# EAGLE design epaper (EAGLE 7.2.0)
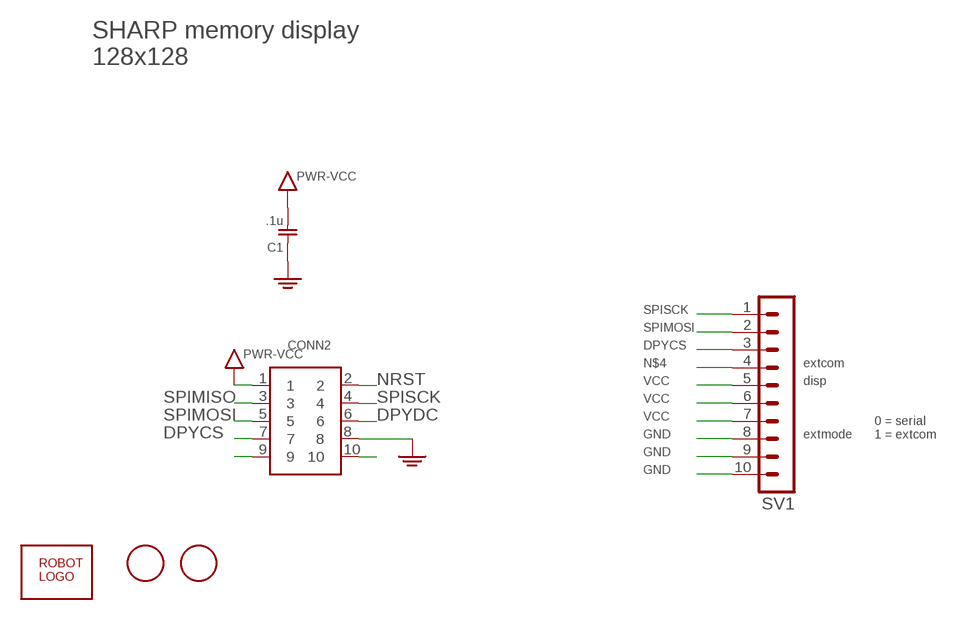
[diagram p0: schematic, sheet 1]

## Parts
C1  .1u  C0603  [SMD0603]
CONN2  HEADER-5X2-PTH  [HEADER-5X2-PTH]
SV1  MA10-1-M05/FFC  [M05-1X10-RA]
U$1  ROBOTMAN-LOGO2  [ROBOTMAN-LOGO2]
U$2  FIDUCIAL  [FIDUCIAL_1MM]
U$3  FIDUCIAL  [FIDUCIAL_1MM]

## Nets
DPYCS: CONN2.7 SV1.3
DPYDC: CONN2.6
GND: C1.1 CONN2.8 SV1.8 SV1.9 SV1.10 ; supply symbol labelled PWR-GND
N$4: SV1.4
N$12: CONN2.9
N$19: CONN2.10
NRST: CONN2.2
SPIMISO: CONN2.3
SPIMOSI: CONN2.5 SV1.2
SPISCK: CONN2.4 SV1.1
VCC: C1.2 CONN2.1 SV1.5 SV1.6 SV1.7 ; supply symbol labelled PWR-VCC

## Notes on the sheet
- SHARP memory display
  128x128
- extcom
- disp
- extmode
- 0 = serial
  1 = extcom

## Library data of the parts
C1 = jaw:C
CONN2 = jaw:HEADER-5X2
SV1 = jaw:MA10-1: PIN HEADER
U$1 = jaw:ROBOTMAN-LOGO
U$2 U$3 = adafruit:FIDUCIAL: For use by pick and place machines to calibrate the vision/machine, 1mm By microbuilder.eu

## Board
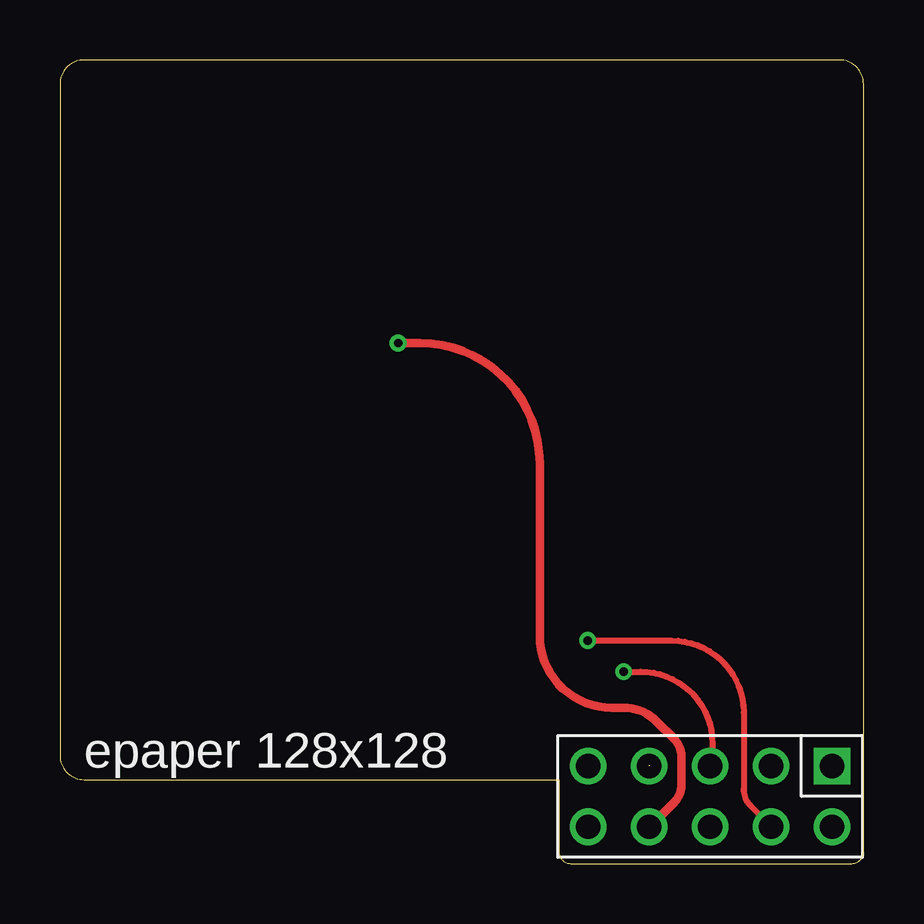
[diagram p1: board, top side]
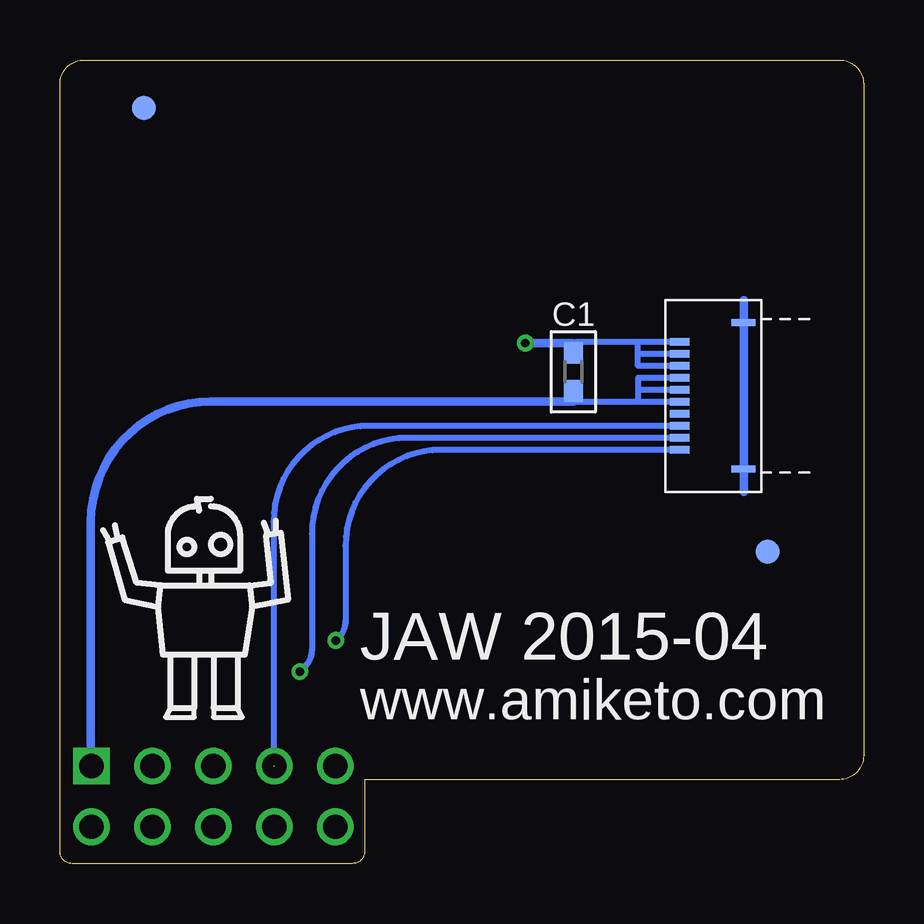
[diagram p2: board, bottom side, seen from below]

Size 33.5 x 33.5 mm. Coordinates in mm from the lower left corner, seen from the top.
Outline: 20.8,3.5 20.8,0.5 arc90 21.3,0 33,0 arc90 33.5,0.5 33.5,32.5 arc90 32.5,33.5 1,33.5 arc90 0,32.5 0,4.5 arc90 1,3.5 20.5,3.5 20.8,3.5
Copper layers (1*16): Top 0.0356mm / dielectric 1.5011mm / Bottom 0.0356mm
Design rules "LaenPCBOrder *": minimum track width 6mil, minimum drill 13mil, track to track 6mil, track to pad 6mil, pad to pad 6mil, via to via 6mil, smd to smd 6mil, copper to edge 15mil, drill to drill 6mil, minimum pad ring 7mil, minimum via ring 7mil, stop-mask expansion 4mil, vias tented up to drill 0.5mm, thermal gap 10mil

### Footprints (pad centres in the part's own frame; a part is rotated, then mirrored left to right if it is on the bottom)
SMD0603 = smd 0.9 x 0.8: 1 -0.8,0; 2 0.8,0
HEADER-5X2-PTH = drill 1.016 square: 1 -5.08,-1.27 | drill 1.016: 2 -5.08,1.27; 3 -2.54,-1.27; 4 -2.54,1.27; 5 0,-1.27; 6 0,1.27; 7 2.54,-1.27; 8 2.54,1.27; 9 5.08,-1.27; 10 5.08,1.27
M05-1X10-RA = smd 0.3 x 0.8: 1 -2.25,1.67; 2 -1.75,1.67; 3 -1.25,1.67; 4 -0.75,1.67; 5 -0.25,1.67; 6 0.25,1.67; 7 0.75,1.67; 8 1.25,1.67; 9 1.75,1.67; 10 2.25,1.67 | smd 0.3 x 1: P$13 3.05,-0.98; P$14 -3.05,-0.98
FIDUCIAL_1MM = smd 1 x 1: 1 0,0

### Placement (x,y rotation side)
C1  12.1,20.5 270 bottom
CONN2  27.1,2.8 180 top
SV1  6,19.5 90 bottom
U$1  27.5,10.5 0 bottom
U$2  30,31.5 0 bottom
U$3  4,13 0 bottom

### Tracks (layer width: path | path; a pad name or v marks a point on that pad's centre or on a via)
DPYCS  (1 unrouted)
  Bottom 0.25: SV1.3 20.6,18.25 arc-90 24.6,14.25 24.6,4.08
GND  (via drill 0.35)
  Top 0.35: v14.1,21.7 15,21.7 arc-90 20,16.7 20,9.5 arc90 23,6.5 23.47,6.5 arc-45 24.89,5.91 25.61,5.19 arc-45 25.9,4.49 25.9,3.25 arc-45 25.61,2.55 24.59,1.53 CONN2.8
  Bottom 0.25: SV1.10 9.4,21.75 | 9.4,21.75 11.98,21.75 C1.1 | SV1.9 9.4,21.25 | 9.4,21.25 9.4,21.75 | SV1.8 9.4,20.75 9.4,21.25
  Bottom 0.35: v14.1,21.7 12.13,21.7 C1.1
N$1
  Bottom 0.35: 5,15.5 5,23.5
SPIMOSI  (via drill 0.35)
  Top 0.25: v23.5,8 24.2,8 arc-90 27.2,5 27.2,4.14 27.13,4.07 CONN2.5
  Bottom 0.25: SV1.2 19,17.75 arc-90 23,13.75 23,8.91 arc45 23.29,8.21 v23.5,8
SPISCK  (via drill 0.35)
  Top 0.25: v22,9.3 25.5,9.3 arc-90 28.5,6.3 28.5,3.11 arc45 28.79,2.41 29.64,1.56 CONN2.4
  Bottom 0.25: SV1.1 17.6,17.25 arc-90 21.6,13.25 21.6,10.11 arc45 21.89,9.41 v22,9.3
VCC
  Bottom 0.25: SV1.5 9.4,19.25 | SV1.6 9.4,19.75 | 9.4,19.75 9.4,19.25 | SV1.7 9.4,20.25 9.4,19.75 | 9.4,19.25 12.09,19.25 C1.2
  Bottom 0.35: 12.13,19.3 C1.2 12.1,19.26 27.21,19.26 arc-90 32.21,14.26 32.21,4.1 CONN2.1

### Text on the board
tPlace: epaper 128x128
bPlace: JAW 2015-04 | www.amiketo.com